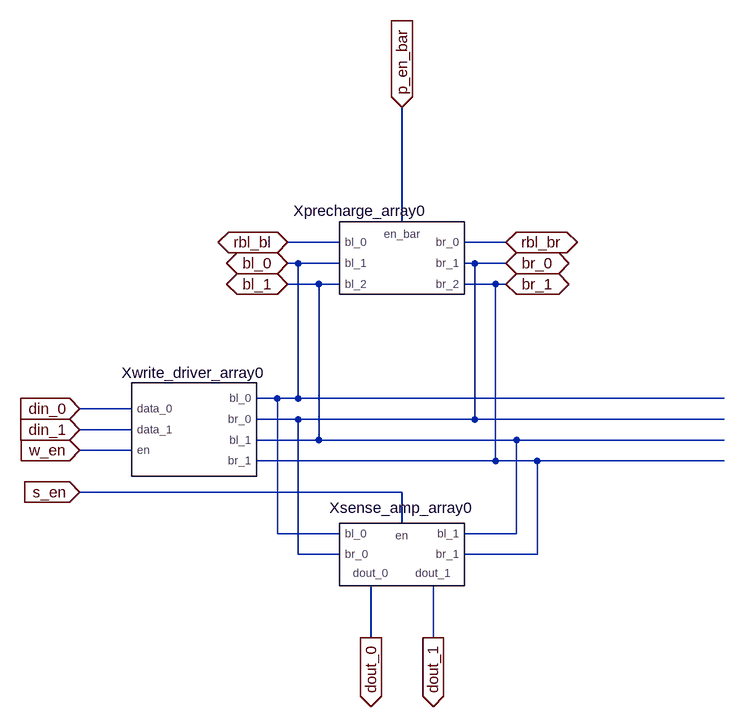
[diagram p0: schematic sram_16x2_port_data.asc]
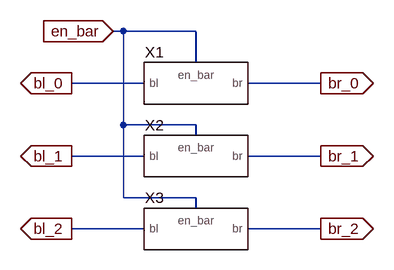
[diagram p1: sub-circuit sram_16x2_precharge_array.asc]
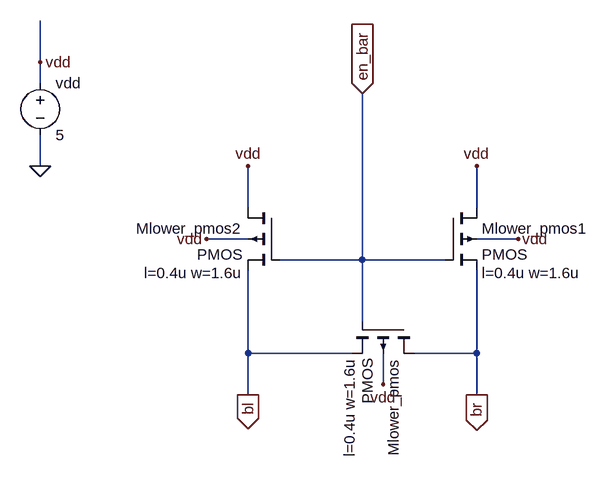
[diagram p2: sub-circuit sram_16x2_precharge_0.asc]
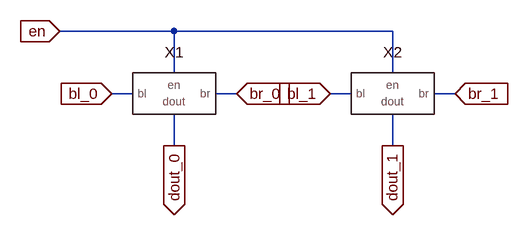
[diagram p3: sub-circuit sram_16x2_sense_amp_array.asc]
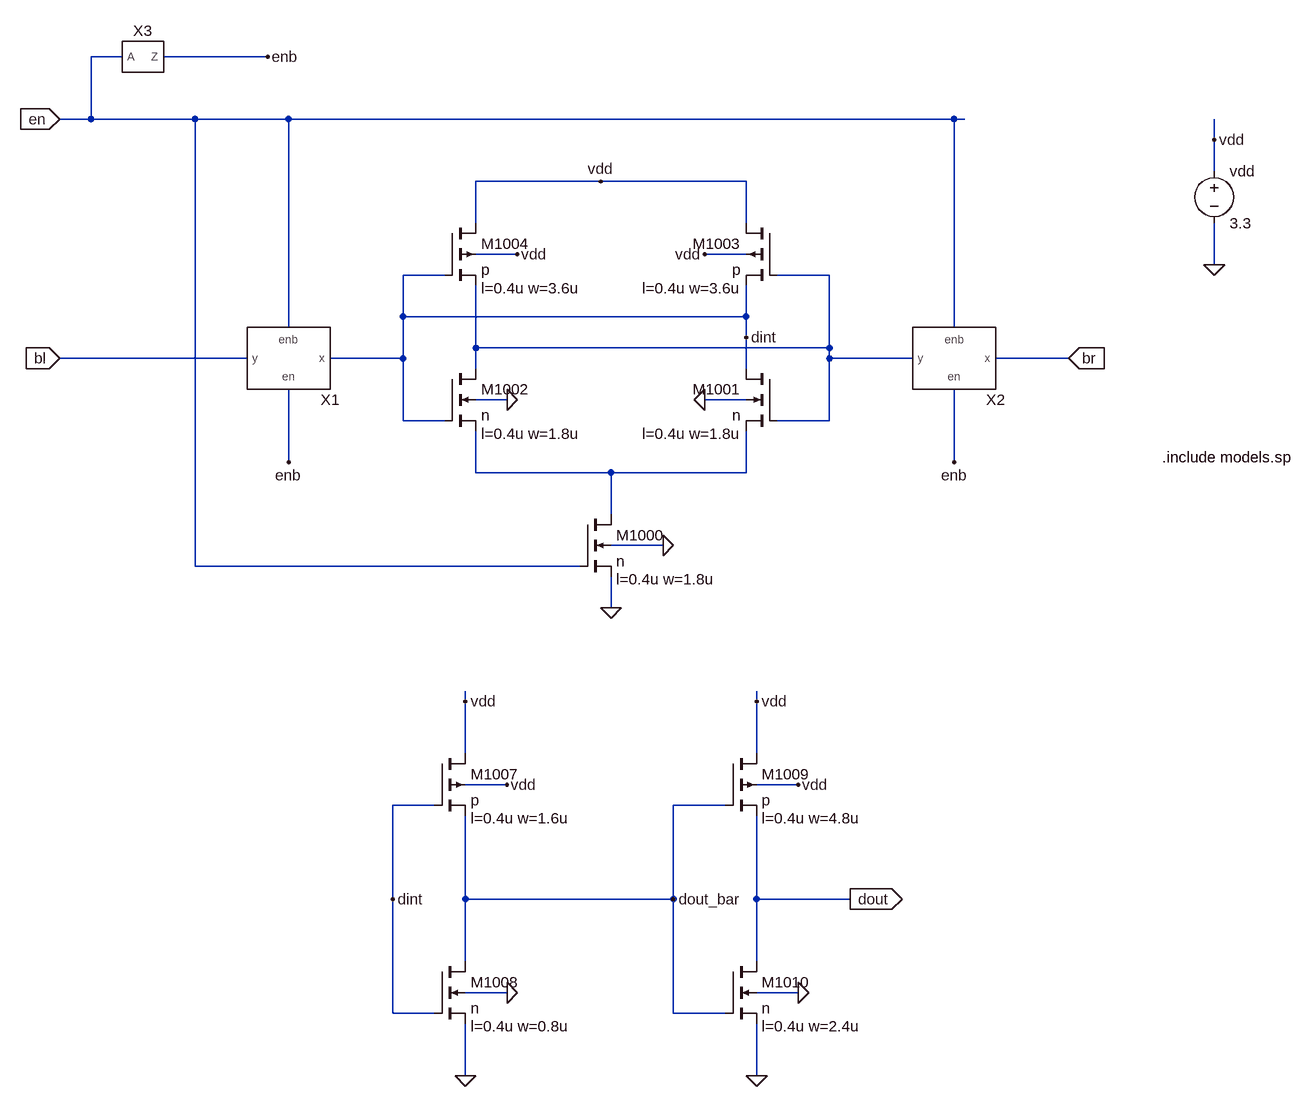
[diagram p4: sub-circuit sense_amp.asc]
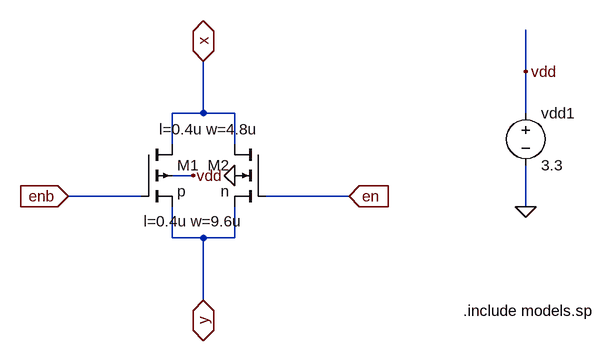
[diagram p5: sub-circuit tri_gate.asc]
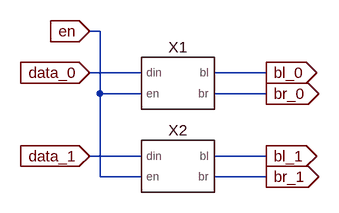
[diagram p6: sub-circuit sram_16x2_write_driver_array.asc]
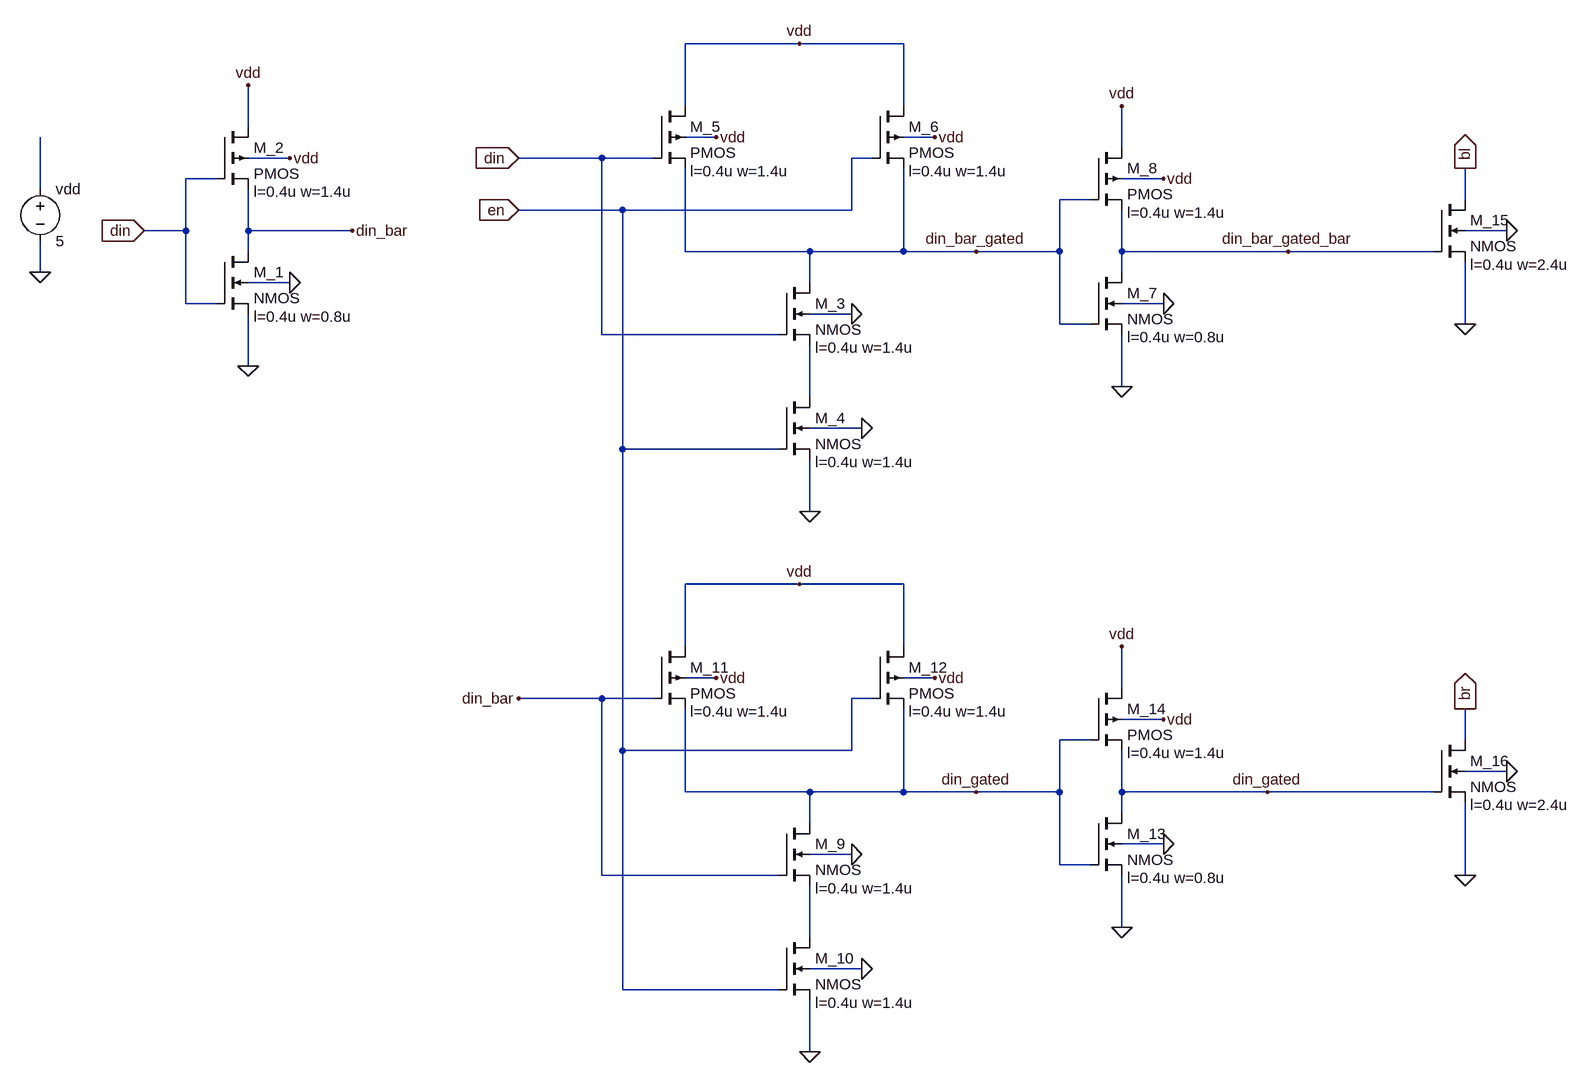
[diagram p7: sub-circuit write_driver.asc]
sram_16x2_port_data.asc, the LTspice schematic file:
Version 4
SHEET 1 880 828
WIRE -144 48 -144 -128
WIRE -240 80 -320 80
WIRE 16 80 -48 80
WIRE -304 112 -320 112
WIRE -240 112 -304 112
WIRE -32 112 -48 112
WIRE 16 112 -32 112
WIRE -272 144 -320 144
WIRE -240 144 -272 144
WIRE 0 144 -48 144
WIRE 16 144 0 144
WIRE -336 320 -368 320
WIRE -304 320 -304 112
WIRE -304 320 -336 320
WIRE 352 320 -304 320
WIRE -560 336 -640 336
WIRE -304 352 -368 352
WIRE -32 352 -32 112
WIRE -32 352 -304 352
WIRE 352 352 -32 352
WIRE -560 368 -640 368
WIRE -272 384 -272 144
WIRE -272 384 -368 384
WIRE 32 384 -272 384
WIRE 352 384 32 384
WIRE -560 400 -640 400
WIRE 0 416 0 144
WIRE 0 416 -368 416
WIRE 64 416 0 416
WIRE 352 416 64 416
WIRE -144 464 -640 464
WIRE -144 512 -144 464
WIRE -336 528 -336 320
WIRE -240 528 -336 528
WIRE 32 528 32 384
WIRE 32 528 -48 528
WIRE -304 560 -304 352
WIRE -240 560 -304 560
WIRE 64 560 64 416
WIRE 64 560 -48 560
WIRE -192 688 -192 608
WIRE -96 688 -96 608
FLAG -320 80 rbl_bl
IOPIN -320 80 BiDir
FLAG 16 80 rbl_br
IOPIN 16 80 BiDir
FLAG -320 112 bl_0
IOPIN -320 112 BiDir
FLAG -320 144 bl_1
IOPIN -320 144 BiDir
FLAG 16 112 br_0
IOPIN 16 112 BiDir
FLAG 16 144 br_1
IOPIN 16 144 BiDir
FLAG -144 -128 p_en_bar
IOPIN -144 -128 In
FLAG -640 336 din_0
IOPIN -640 336 In
FLAG -640 368 din_1
IOPIN -640 368 In
FLAG -640 400 w_en
IOPIN -640 400 In
FLAG -192 688 dout_0
IOPIN -192 688 Out
FLAG -96 688 dout_1
IOPIN -96 688 Out
FLAG -640 464 s_en
IOPIN -640 464 In
SYMBOL sram_16x2_precharge_array -144 144 R0
SYMATTR InstName Xprecharge_array0
SYMBOL sram_16x2_sense_amp_array -144 592 R0
SYMATTR InstName Xsense_amp_array0
SYMBOL sram_16x2_write_driver_array -464 368 R0
SYMATTR InstName Xwrite_driver_array0

sram_16x2_precharge_array.asc, the sub-circuit schematic file:
Version 4
SHEET 1 880 680
WIRE 80 16 64 16
WIRE 192 16 80 16
WIRE 192 64 192 16
WIRE 112 96 0 96
WIRE 384 96 272 96
WIRE 80 160 80 16
WIRE 192 160 80 160
WIRE 192 176 192 160
WIRE 112 208 0 208
WIRE 384 208 272 208
WIRE 80 272 80 160
WIRE 192 272 80 272
WIRE 192 288 192 272
WIRE 112 320 0 320
WIRE 384 320 272 320
FLAG 64 16 en_bar
IOPIN 64 16 In
FLAG 0 96 bl_0
IOPIN 0 96 Out
FLAG 0 208 bl_1
IOPIN 0 208 Out
FLAG 0 320 bl_2
IOPIN 0 320 Out
FLAG 384 96 br_0
IOPIN 384 96 Out
FLAG 384 208 br_1
IOPIN 384 208 Out
FLAG 384 320 br_2
IOPIN 384 320 Out
SYMBOL sram_16x2_precharge_0 192 96 R0
SYMATTR InstName X1
SYMBOL sram_16x2_precharge_0 192 208 R0
SYMATTR InstName X2
SYMBOL sram_16x2_precharge_0 192 320 R0
SYMATTR InstName X3

sram_16x2_precharge_0.asc, the sub-circuit schematic file:
Version 4
SHEET 1 880 680
WIRE -448 -64 -448 -128
WIRE -448 -32 -448 -64
WIRE -448 96 -448 48
WIRE -128 160 -128 96
WIRE 224 160 224 96
WIRE -128 208 -192 208
WIRE 288 208 224 208
WIRE 48 240 48 -16
WIRE 48 240 -80 240
WIRE 176 240 48 240
WIRE 48 336 48 240
WIRE -128 384 -128 256
WIRE 32 384 -128 384
WIRE 224 384 224 256
WIRE 224 384 128 384
WIRE 80 432 80 384
WIRE -128 448 -128 384
WIRE 224 448 224 384
FLAG -448 96 0
FLAG 288 208 vdd
FLAG -192 208 vdd
FLAG 80 432 vdd
FLAG 224 96 vdd
FLAG -128 96 vdd
FLAG -128 448 bl
IOPIN -128 448 Out
FLAG 224 448 br
IOPIN 224 448 Out
FLAG 48 -16 en_bar
IOPIN 48 -16 In
FLAG -448 -64 vdd
SYMBOL pmos4 128 336 R90
WINDOW 123 56 100 Left 2
SYMATTR InstName Mlower_pmos
SYMATTR Value2 l=0.4u w=1.6u
SYMBOL pmos4 176 160 R0
WINDOW 123 56 100 Left 2
SYMATTR InstName Mlower_pmos1
SYMATTR Value2 l=0.4u w=1.6u
SYMBOL pmos4 -80 160 M0
WINDOW 123 56 100 Left 2
SYMATTR InstName Mlower_pmos2
SYMATTR Value2 l=0.4u w=1.6u
SYMBOL voltage -448 -48 R0
SYMATTR InstName vdd
SYMATTR Value 5

sram_16x2_sense_amp_array.asc, the sub-circuit schematic file:
Version 4
SHEET 1 880 680
WIRE 176 32 0 32
WIRE 512 32 176 32
WIRE 176 96 176 32
WIRE 512 96 512 32
WIRE 112 128 80 128
WIRE 272 128 240 128
WIRE 448 128 416 128
WIRE 608 128 576 128
WIRE 176 208 176 160
WIRE 512 208 512 160
FLAG 0 32 en
IOPIN 0 32 In
FLAG 80 128 bl_0
IOPIN 80 128 In
FLAG 416 128 bl_1
IOPIN 416 128 In
FLAG 272 128 br_0
IOPIN 272 128 In
FLAG 608 128 br_1
IOPIN 608 128 In
FLAG 176 208 dout_0
IOPIN 176 208 Out
FLAG 512 208 dout_1
IOPIN 512 208 Out
SYMBOL sense_amp 176 144 R0
SYMATTR InstName X1
SYMBOL sense_amp 512 144 R0
SYMATTR InstName X2

sense_amp.asc, the sub-circuit schematic file:
Version 4
SHEET 1 2104 2356
WIRE -2240 768 -2288 768
WIRE -2016 768 -2176 768
WIRE -2288 864 -2288 768
WIRE -2288 864 -2336 864
WIRE -2128 864 -2288 864
WIRE -1984 864 -2128 864
WIRE -960 864 -1984 864
WIRE -944 864 -960 864
WIRE -560 896 -560 864
WIRE -560 944 -560 896
WIRE -1504 960 -1696 960
WIRE -1280 960 -1504 960
WIRE -1696 1024 -1696 960
WIRE -1280 1024 -1280 960
WIRE -1632 1072 -1696 1072
WIRE -1280 1072 -1344 1072
WIRE -560 1088 -560 1024
WIRE -1744 1104 -1808 1104
WIRE -1152 1104 -1232 1104
WIRE -1808 1168 -1808 1104
WIRE -1280 1168 -1280 1120
WIRE -1280 1168 -1808 1168
WIRE -1984 1184 -1984 864
WIRE -960 1184 -960 864
WIRE -1280 1200 -1280 1168
WIRE -1696 1216 -1696 1120
WIRE -1152 1216 -1152 1104
WIRE -1152 1216 -1696 1216
WIRE -2048 1232 -2336 1232
WIRE -1808 1232 -1808 1168
WIRE -1808 1232 -1920 1232
WIRE -1152 1232 -1152 1216
WIRE -1024 1232 -1152 1232
WIRE -784 1232 -896 1232
WIRE -1696 1248 -1696 1216
WIRE -1280 1248 -1280 1200
WIRE -1648 1296 -1696 1296
WIRE -1280 1296 -1344 1296
WIRE -1808 1328 -1808 1232
WIRE -1744 1328 -1808 1328
WIRE -1152 1328 -1152 1232
WIRE -1152 1328 -1232 1328
WIRE -1984 1392 -1984 1280
WIRE -960 1392 -960 1280
WIRE -1696 1408 -1696 1344
WIRE -1488 1408 -1696 1408
WIRE -1280 1408 -1280 1344
WIRE -1280 1408 -1488 1408
WIRE -1488 1472 -1488 1408
WIRE -1408 1520 -1488 1520
WIRE -2128 1552 -2128 864
WIRE -1536 1552 -2128 1552
WIRE -1488 1616 -1488 1568
WIRE -1712 1760 -1712 1744
WIRE -1264 1760 -1264 1744
WIRE -1712 1840 -1712 1760
WIRE -1264 1840 -1264 1760
WIRE -1648 1888 -1712 1888
WIRE -1200 1888 -1264 1888
WIRE -1760 1920 -1824 1920
WIRE -1312 1920 -1392 1920
WIRE -1824 2064 -1824 1920
WIRE -1712 2064 -1712 1936
WIRE -1392 2064 -1392 1920
WIRE -1392 2064 -1712 2064
WIRE -1264 2064 -1264 1936
WIRE -1120 2064 -1264 2064
WIRE -1712 2160 -1712 2064
WIRE -1264 2160 -1264 2064
WIRE -1648 2208 -1712 2208
WIRE -1200 2208 -1264 2208
WIRE -1824 2240 -1824 2064
WIRE -1760 2240 -1824 2240
WIRE -1392 2240 -1392 2064
WIRE -1312 2240 -1392 2240
WIRE -1712 2336 -1712 2256
WIRE -1264 2336 -1264 2256
FLAG -1712 2336 0
FLAG -560 1088 0
FLAG -560 896 vdd
FLAG -1264 1760 vdd
FLAG -1712 1760 vdd
FLAG -1824 2064 dint
FLAG -1392 2064 dout_bar
FLAG -1264 2336 0
FLAG -1120 2064 dout
IOPIN -1120 2064 Out
FLAG -1488 1616 0
FLAG -1280 1200 dint
FLAG -1504 960 vdd
FLAG -1648 2208 0
FLAG -1200 2208 0
FLAG -1344 1296 0
FLAG -1648 1296 0
FLAG -1408 1520 0
FLAG -1632 1072 vdd
FLAG -1344 1072 vdd
FLAG -1200 1888 vdd
FLAG -1648 1888 vdd
FLAG -2336 864 en
IOPIN -2336 864 In
FLAG -2336 1232 bl
IOPIN -2336 1232 In
FLAG -784 1232 br
IOPIN -784 1232 In
FLAG -2016 768 enb
FLAG -960 1392 enb
FLAG -1984 1392 enb
SYMBOL nmos4 -1536 1472 R0
WINDOW 123 56 100 Left 2
SYMATTR Value2 l=0.4u w=1.8u
SYMATTR InstName M1000
SYMATTR Value n
SYMBOL nmos4 -1232 1248 M0
WINDOW 123 56 100 Left 2
SYMATTR Value2 l=0.4u w=1.8u
SYMATTR InstName M1001
SYMATTR Value n
SYMBOL nmos4 -1744 1248 R0
WINDOW 123 56 100 Left 2
SYMATTR Value2 l=0.4u w=1.8u
SYMATTR InstName M1002
SYMATTR Value n
SYMBOL nmos4 -1760 2160 R0
WINDOW 123 56 100 Left 2
SYMATTR Value2 l=0.4u w=0.8u
SYMATTR InstName M1008
SYMATTR Value n
SYMBOL nmos4 -1312 2160 R0
WINDOW 123 56 100 Left 2
SYMATTR Value2 l=0.4u w=2.4u
SYMATTR InstName M1010
SYMATTR Value n
SYMBOL pmos4 -1232 1024 M0
WINDOW 123 56 100 Left 2
SYMATTR Value2 l=0.4u w=3.6u
SYMATTR InstName M1003
SYMATTR Value p
SYMBOL pmos4 -1744 1024 R0
WINDOW 123 56 100 Left 2
SYMATTR Value2 l=0.4u w=3.6u
SYMATTR InstName M1004
SYMATTR Value p
SYMBOL pmos4 -1312 1840 R0
WINDOW 123 56 100 Left 2
SYMATTR Value2 l=0.4u w=4.8u
SYMATTR InstName M1009
SYMATTR Value p
SYMBOL pmos4 -1760 1840 R0
WINDOW 123 56 100 Left 2
SYMATTR Value2 l=0.4u w=1.6u
SYMATTR InstName M1007
SYMATTR Value p
SYMBOL voltage -560 928 R0
SYMATTR InstName vdd
SYMATTR Value 3.3
SYMBOL tri_gate -1984 1232 R180
SYMATTR InstName X1
SYMBOL tri_gate -960 1232 R180
SYMATTR InstName X2
SYMBOL inv -2208 768 R0
SYMATTR InstName X3
TEXT -640 1384 Left 2 !.include models.sp

tri_gate.asc, the sub-circuit schematic file:
Version 4
SHEET 1 880 680
WIRE 576 -16 576 -80
WIRE 80 48 80 -32
WIRE 80 48 32 48
WIRE 128 48 80 48
WIRE 576 48 576 -16
WIRE 32 96 32 48
WIRE 128 96 128 48
WIRE 64 144 32 144
WIRE -16 176 -128 176
WIRE 304 176 176 176
WIRE 576 192 576 128
WIRE 32 240 32 192
WIRE 80 240 32 240
WIRE 128 240 128 192
WIRE 128 240 80 240
WIRE 80 336 80 240
FLAG 128 144 0
FLAG 64 144 vdd
FLAG 576 192 0
FLAG 576 -16 vdd
FLAG 80 336 y
IOPIN 80 336 BiDir
FLAG 80 -32 x
IOPIN 80 -32 BiDir
FLAG 304 176 en
IOPIN 304 176 In
FLAG -128 176 enb
IOPIN -128 176 In
SYMBOL pmos4 -16 96 R0
WINDOW 123 4 118 Left 2
SYMATTR Value2 l=0.4u w=9.6u
SYMATTR InstName M1
SYMATTR Value p
SYMBOL nmos4 176 96 M0
WINDOW 123 12 -23 Left 2
SYMATTR Value2 l=0.4u w=4.8u
SYMATTR InstName M2
SYMATTR Value n
SYMBOL voltage 576 32 R0
WINDOW 123 0 0 Left 0
WINDOW 39 0 0 Left 0
SYMATTR InstName vdd1
SYMATTR Value 3.3
TEXT 480 352 Left 2 !.include models.sp

sram_16x2_write_driver_array.asc, the sub-circuit schematic file:
Version 4
SHEET 1 880 680
WIRE 64 64 48 64
WIRE 128 128 48 128
WIRE 320 128 240 128
WIRE 64 160 64 64
WIRE 128 160 64 160
WIRE 320 160 240 160
WIRE 128 256 48 256
WIRE 320 256 240 256
WIRE 64 288 64 160
WIRE 128 288 64 288
WIRE 320 288 240 288
FLAG 48 64 en
IOPIN 48 64 In
FLAG 48 128 data_0
IOPIN 48 128 In
FLAG 48 256 data_1
IOPIN 48 256 In
FLAG 320 128 bl_0
IOPIN 320 128 Out
FLAG 320 256 bl_1
IOPIN 320 256 Out
FLAG 320 160 br_0
IOPIN 320 160 Out
FLAG 320 288 br_1
IOPIN 320 288 Out
SYMBOL write_driver 176 144 R0
SYMATTR InstName X1
SYMBOL write_driver 176 272 R0
SYMATTR InstName X2

write_driver.asc, the sub-circuit schematic file:
Version 4
SHEET 1 2472 1444
WIRE 928 -128 752 -128
WIRE 1088 -128 928 -128
WIRE 752 -32 752 -128
WIRE 1088 -32 1088 -128
WIRE 80 0 80 -64
WIRE 800 16 752 16
WIRE 1136 16 1088 16
WIRE 1424 32 1424 -32
WIRE 144 48 80 48
WIRE 624 48 496 48
WIRE 704 48 624 48
WIRE 1040 48 1008 48
WIRE 32 80 -16 80
WIRE 1488 80 1424 80
WIRE -240 96 -240 16
WIRE 1376 112 1328 112
WIRE 1952 112 1952 64
WIRE 656 128 496 128
WIRE 1008 128 1008 48
WIRE 1008 128 656 128
WIRE -16 160 -16 80
WIRE -16 160 -80 160
WIRE 80 160 80 96
WIRE 240 160 80 160
WIRE 2016 160 1952 160
WIRE 80 192 80 160
WIRE 752 192 752 64
WIRE 944 192 752 192
WIRE 1088 192 1088 64
WIRE 1088 192 944 192
WIRE 1200 192 1088 192
WIRE 1328 192 1328 112
WIRE 1328 192 1200 192
WIRE 1424 192 1424 128
WIRE 1680 192 1424 192
WIRE 1904 192 1680 192
WIRE -240 224 -240 176
WIRE 1424 224 1424 192
WIRE 144 240 80 240
WIRE 944 240 944 192
WIRE -16 272 -16 160
WIRE 32 272 -16 272
WIRE 1488 272 1424 272
WIRE 1008 288 944 288
WIRE 1328 304 1328 192
WIRE 1376 304 1328 304
WIRE 1952 304 1952 208
WIRE 624 320 624 48
WIRE 896 320 624 320
WIRE 80 368 80 288
WIRE 1424 400 1424 320
WIRE 944 416 944 336
WIRE 1024 464 944 464
WIRE 656 496 656 128
WIRE 896 496 656 496
WIRE 944 592 944 512
WIRE 928 704 752 704
WIRE 1088 704 928 704
WIRE 752 800 752 704
WIRE 1088 800 1088 704
WIRE 800 848 752 848
WIRE 1136 848 1088 848
WIRE 1424 864 1424 800
WIRE 624 880 496 880
WIRE 704 880 624 880
WIRE 1040 880 1008 880
WIRE 1488 912 1424 912
WIRE 1376 944 1328 944
WIRE 1952 944 1952 896
WIRE 656 960 656 496
WIRE 1008 960 1008 880
WIRE 1008 960 656 960
WIRE 2016 992 1952 992
WIRE 752 1024 752 896
WIRE 944 1024 752 1024
WIRE 1088 1024 1088 896
WIRE 1088 1024 944 1024
WIRE 1200 1024 1088 1024
WIRE 1328 1024 1328 944
WIRE 1328 1024 1200 1024
WIRE 1424 1024 1424 960
WIRE 1648 1024 1424 1024
WIRE 1904 1024 1648 1024
WIRE 1424 1056 1424 1024
WIRE 944 1072 944 1024
WIRE 1488 1104 1424 1104
WIRE 1008 1120 944 1120
WIRE 1328 1136 1328 1024
WIRE 1376 1136 1328 1136
WIRE 624 1152 624 880
WIRE 896 1152 624 1152
WIRE 1952 1152 1952 1040
WIRE 1424 1232 1424 1152
WIRE 944 1248 944 1168
WIRE 1024 1296 944 1296
WIRE 656 1328 656 960
WIRE 896 1328 656 1328
WIRE 944 1424 944 1344
FLAG -240 224 0
FLAG 80 368 0
FLAG 80 -64 vdd
FLAG -80 160 din
IOPIN -80 160 In
FLAG 240 160 din_bar
FLAG 944 592 0
FLAG 1024 464 0
FLAG 1008 288 0
FLAG 144 240 0
FLAG 144 48 vdd
FLAG 800 16 vdd
FLAG 1136 16 vdd
FLAG 1200 192 din_bar_gated
FLAG 496 48 din
IOPIN 496 48 In
FLAG 496 128 en
IOPIN 496 128 In
FLAG 928 -128 vdd
FLAG 1424 400 0
FLAG 1424 -32 vdd
FLAG 1488 272 0
FLAG 1488 80 vdd
FLAG 1680 192 din_bar_gated_bar
FLAG 944 1424 0
FLAG 1024 1296 0
FLAG 1008 1120 0
FLAG 800 848 vdd
FLAG 1136 848 vdd
FLAG 928 704 vdd
FLAG 1424 1232 0
FLAG 1424 800 vdd
FLAG 1488 1104 0
FLAG 1488 912 vdd
FLAG 496 880 din_bar
FLAG 1200 1024 din_gated
FLAG 1648 1024 din_gated
FLAG 1952 304 0
FLAG 2016 160 0
FLAG 2016 992 0
FLAG 1952 1152 0
FLAG 1952 64 bl
IOPIN 1952 64 Out
FLAG 1952 896 br
IOPIN 1952 896 Out
SYMBOL nmos4 32 192 R0
WINDOW 123 56 100 Left 2
SYMATTR Value2 l=0.4u w=0.8u
SYMATTR InstName M_1
SYMBOL pmos4 32 0 R0
WINDOW 123 56 100 Left 2
SYMATTR Value2 l=0.4u w=1.4u
SYMATTR InstName M_2
SYMBOL voltage -240 80 R0
WINDOW 123 0 0 Left 0
WINDOW 39 0 0 Left 0
SYMATTR InstName vdd
SYMATTR Value 5
SYMBOL nmos4 896 240 R0
WINDOW 123 56 100 Left 2
SYMATTR Value2 l=0.4u w=1.4u
SYMATTR InstName M_3
SYMBOL nmos4 896 416 R0
WINDOW 123 56 100 Left 2
SYMATTR Value2 l=0.4u w=1.4u
SYMATTR InstName M_4
SYMBOL pmos4 704 -32 R0
WINDOW 123 56 100 Left 2
SYMATTR Value2 l=0.4u w=1.4u
SYMATTR InstName M_5
SYMBOL pmos4 1040 -32 R0
WINDOW 123 56 100 Left 2
SYMATTR Value2 l=0.4u w=1.4u
SYMATTR InstName M_6
SYMBOL nmos4 1376 224 R0
WINDOW 123 56 100 Left 2
SYMATTR Value2 l=0.4u w=0.8u
SYMATTR InstName M_7
SYMBOL pmos4 1376 32 R0
WINDOW 123 56 100 Left 2
SYMATTR Value2 l=0.4u w=1.4u
SYMATTR InstName M_8
SYMBOL nmos4 896 1072 R0
WINDOW 123 56 100 Left 2
SYMATTR Value2 l=0.4u w=1.4u
SYMATTR InstName M_9
SYMBOL nmos4 896 1248 R0
WINDOW 123 56 100 Left 2
SYMATTR Value2 l=0.4u w=1.4u
SYMATTR InstName M_10
SYMBOL pmos4 704 800 R0
WINDOW 123 56 100 Left 2
SYMATTR Value2 l=0.4u w=1.4u
SYMATTR InstName M_11
SYMBOL pmos4 1040 800 R0
WINDOW 123 56 100 Left 2
SYMATTR Value2 l=0.4u w=1.4u
SYMATTR InstName M_12
SYMBOL nmos4 1376 1056 R0
WINDOW 123 56 100 Left 2
SYMATTR Value2 l=0.4u w=0.8u
SYMATTR InstName M_13
SYMBOL pmos4 1376 864 R0
WINDOW 123 56 100 Left 2
SYMATTR Value2 l=0.4u w=1.4u
SYMATTR InstName M_14
SYMBOL nmos4 1904 112 R0
WINDOW 123 56 100 Left 2
SYMATTR Value2 l=0.4u w=2.4u
SYMATTR InstName M_15
SYMBOL nmos4 1904 944 R0
WINDOW 123 56 100 Left 2
SYMATTR Value2 l=0.4u w=2.4u
SYMATTR InstName M_16

The netlist it stands for:
* sram_16x2_port_data.asc
XXprecharge_array0 p_en_bar rbl_bl bl_0 bl_1 rbl_br br_0 br_1 sram_16x2_precharge_array
XXsense_amp_array0 bl_0 bl_1 br_0 br_1 s_en dout_0 dout_1 sram_16x2_sense_amp_array
XXwrite_driver_array0 din_0 din_1 w_en bl_0 bl_1 br_0 br_1 sram_16x2_write_driver_array

* block symbol definitions
.subckt sram_16x2_precharge_array en_bar bl_0 bl_1 bl_2 br_0 br_1 br_2
XX1 en_bar bl_0 br_0 sram_16x2_precharge_0
XX2 en_bar bl_1 br_1 sram_16x2_precharge_0
XX3 en_bar bl_2 br_2 sram_16x2_precharge_0
.ends sram_16x2_precharge_array

.subckt sram_16x2_precharge_0 en_bar bl br
Mlower_pmos br en_bar bl vdd PMOS l=0.4u w=1.6u
Mlower_pmos1 vdd en_bar br vdd PMOS l=0.4u w=1.6u
Mlower_pmos2 vdd en_bar bl vdd PMOS l=0.4u w=1.6u
vdd vdd 0 5
.ends sram_16x2_precharge_0

.subckt sram_16x2_sense_amp_array bl_0 bl_1 br_0 br_1 en dout_0 dout_1
XX1 bl_0 br_0 en dout_0 sense_amp
XX2 bl_1 br_1 en dout_1 sense_amp
.ends sram_16x2_sense_amp_array

.subckt sense_amp bl br en dout
M1000 N002 en 0 0 n l=0.4u w=1.8u
M1001 dint N001 N002 0 n l=0.4u w=1.8u
M1002 N001 dint N002 0 n l=0.4u w=1.8u
M1008 dout_bar dint 0 0 n l=0.4u w=0.8u
M1010 dout dout_bar 0 0 n l=0.4u w=2.4u
M1003 vdd N001 dint vdd p l=0.4u w=3.6u
M1004 vdd dint N001 vdd p l=0.4u w=3.6u
M1009 vdd dout_bar dout vdd p l=0.4u w=4.8u
M1007 vdd dint dout_bar vdd p l=0.4u w=1.6u
vdd vdd 0 3.3
XX1 enb en dint bl tri_gate
XX2 enb en br N001 tri_gate
XX3 en enb inv  ; pins A Z
.include models.sp
.ends sense_amp

.subckt tri_gate en enb x y
M1 x enb y vdd p l=0.4u w=9.6u
M2 x en y 0 n l=0.4u w=4.8u
vdd1 vdd 0 3.3
.include models.sp
.ends tri_gate

.subckt sram_16x2_write_driver_array data_0 data_1 en bl_0 bl_1 br_0 br_1
XX1 data_0 en bl_0 br_0 write_driver
XX2 data_1 en bl_1 br_1 write_driver
.ends sram_16x2_write_driver_array

.subckt write_driver din en bl br
M_1 din_bar din 0 0 NMOS l=0.4u w=0.8u
M_2 vdd din din_bar vdd PMOS l=0.4u w=1.4u
vdd N001 0 5
M_3 din_bar_gated din N002 0 NMOS l=0.4u w=1.4u
M_4 N002 en 0 0 NMOS l=0.4u w=1.4u
M_5 vdd din din_bar_gated vdd PMOS l=0.4u w=1.4u
M_6 vdd en din_bar_gated vdd PMOS l=0.4u w=1.4u
M_7 din_bar_gated_bar din_bar_gated 0 0 NMOS l=0.4u w=0.8u
M_8 vdd din_bar_gated din_bar_gated_bar vdd PMOS l=0.4u w=1.4u
M_9 din_gated din_bar N003 0 NMOS l=0.4u w=1.4u
M_10 N003 en 0 0 NMOS l=0.4u w=1.4u
M_11 vdd din_bar din_gated vdd PMOS l=0.4u w=1.4u
M_12 vdd en din_gated vdd PMOS l=0.4u w=1.4u
M_13 din_gated din_gated 0 0 NMOS l=0.4u w=0.8u
M_14 vdd din_gated din_gated vdd PMOS l=0.4u w=1.4u
M_15 bl din_bar_gated_bar 0 0 NMOS l=0.4u w=2.4u
M_16 br din_gated 0 0 NMOS l=0.4u w=2.4u
.ends write_driver

.model NMOS NMOS
.model PMOS PMOS
.lib standard.mos
.backanno
.end